# EAGLE design uno_sensor_shield (EAGLE 9.1.0)

## Sheet 1 of 2
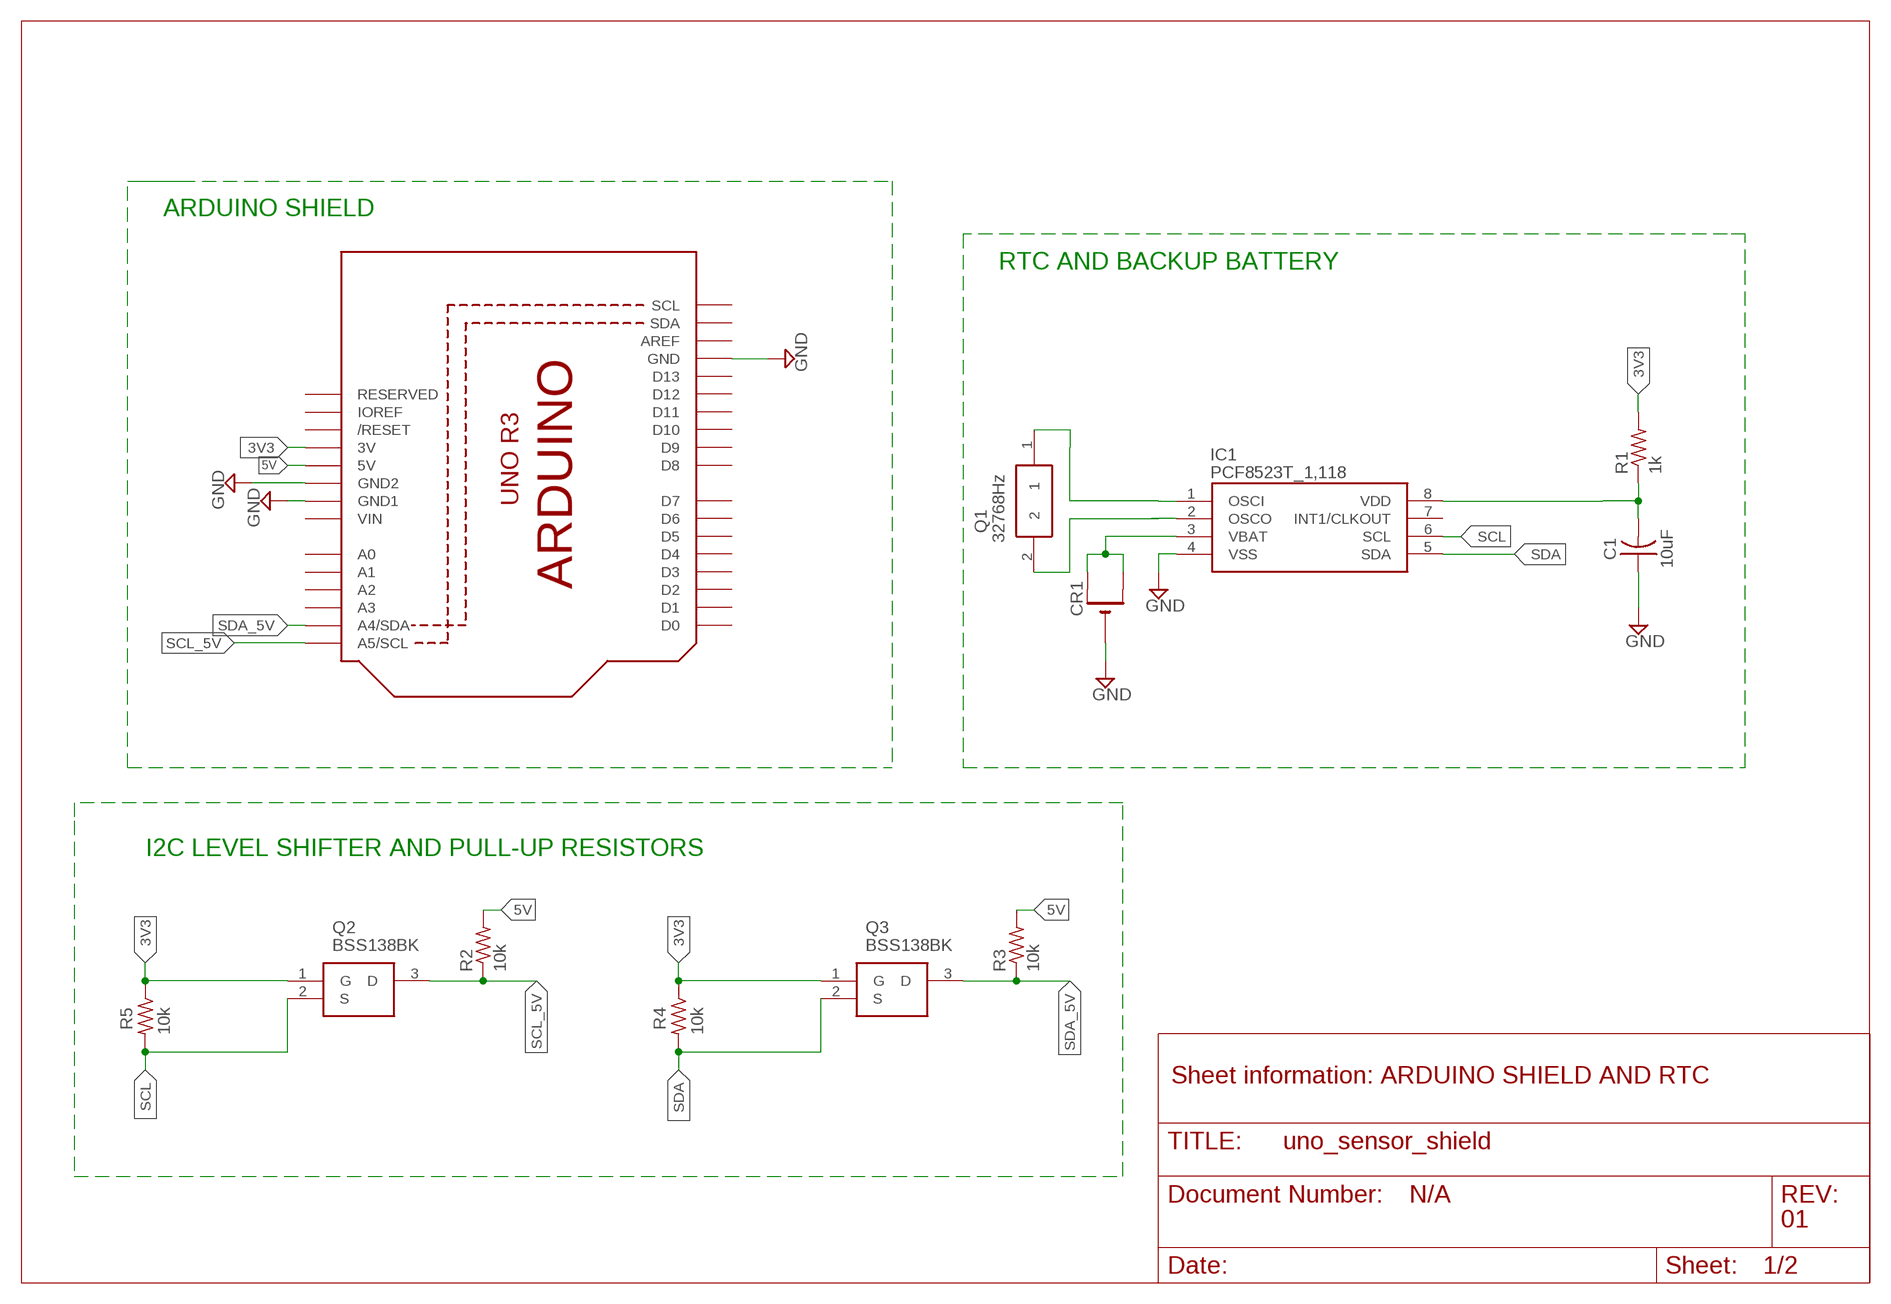
[diagram p0: schematic, sheet 1]

### Parts
C1  10uF  C-USC0805  [C0805]
CR1  CR1220SMT  [CR1220-SMD]
IC1  PCF8523T_1,118  [SOIC127P600X175-8N]
Q1  32768Hz  Q_0.032768-JTX210-12.5-20-T1-L  [Q0032768JTX21012520T1LF]
Q2  BSS138BK  [SOT95P230X110-3N]
Q3  BSS138BK  [SOT95P230X110-3N]
R1  1k  R-US_R0805  [R0805]
R2  10k  R-US_R0805  [R0805]
R3  10k  R-US_R0805  [R0805]
R4  10k  R-US_R0805  [R0805]
R5  10k  R-US_R0805  [R0805]
U1  ARDUINOR3-DIMENSION  [ARDUINOR3]

### Nets
3V3: Q2.1(G) Q3.1(G) R1.2 R4.1 R5.1 U1.3V ; also sheet 2
5V: R2.2 R3.2 U1.5V
GND: C1.1 CR1.- IC1.4(VSS) U1.GND U1.GND1 U1.GND2 ; also sheet 2
N$4: IC1.2(OSCO) Q1.2
N$5: C1.2 IC1.8(VDD) R1.1
N$11: IC1.1(OSCI) Q1.1
SCL: IC1.6(SCL) Q2.2(S) R5.2 ; also sheet 2
SCL_5V: Q2.3(D) R2.1 U1.A5(A5/SCL)
SDA: IC1.5(SDA) Q3.2(S) R4.2 ; also sheet 2
SDA_5V: Q3.3(D) R3.1 U1.A4(A4/SDA)
VBAT: CR1.+$1(+) CR1.+$2(+1) IC1.3(VBAT)
Unconnected: IC1.7(INT1/CLKOUT) U1.A0 U1.A1 U1.A2 U1.A3 U1.AREF U1.D0 U1.D1 U1.D2 U1.D3 U1.D4 U1.D5 U1.D6 U1.D7 U1.D8 U1.D9 U1.D10 U1.D11 U1.D12 U1.D13 U1.IOREF U1.RESERVED U1.RESET(/RESET) U1.SCL U1.SDA

### Notes on the sheet
- ARDUINO SHIELD
- RTC AND BACKUP BATTERY
- I2C LEVEL SHIFTER AND PULL-UP RESISTORS
- Sheet information: ARDUINO SHIELD AND RTC
- N/A
- 01

## Sheet 2 of 2
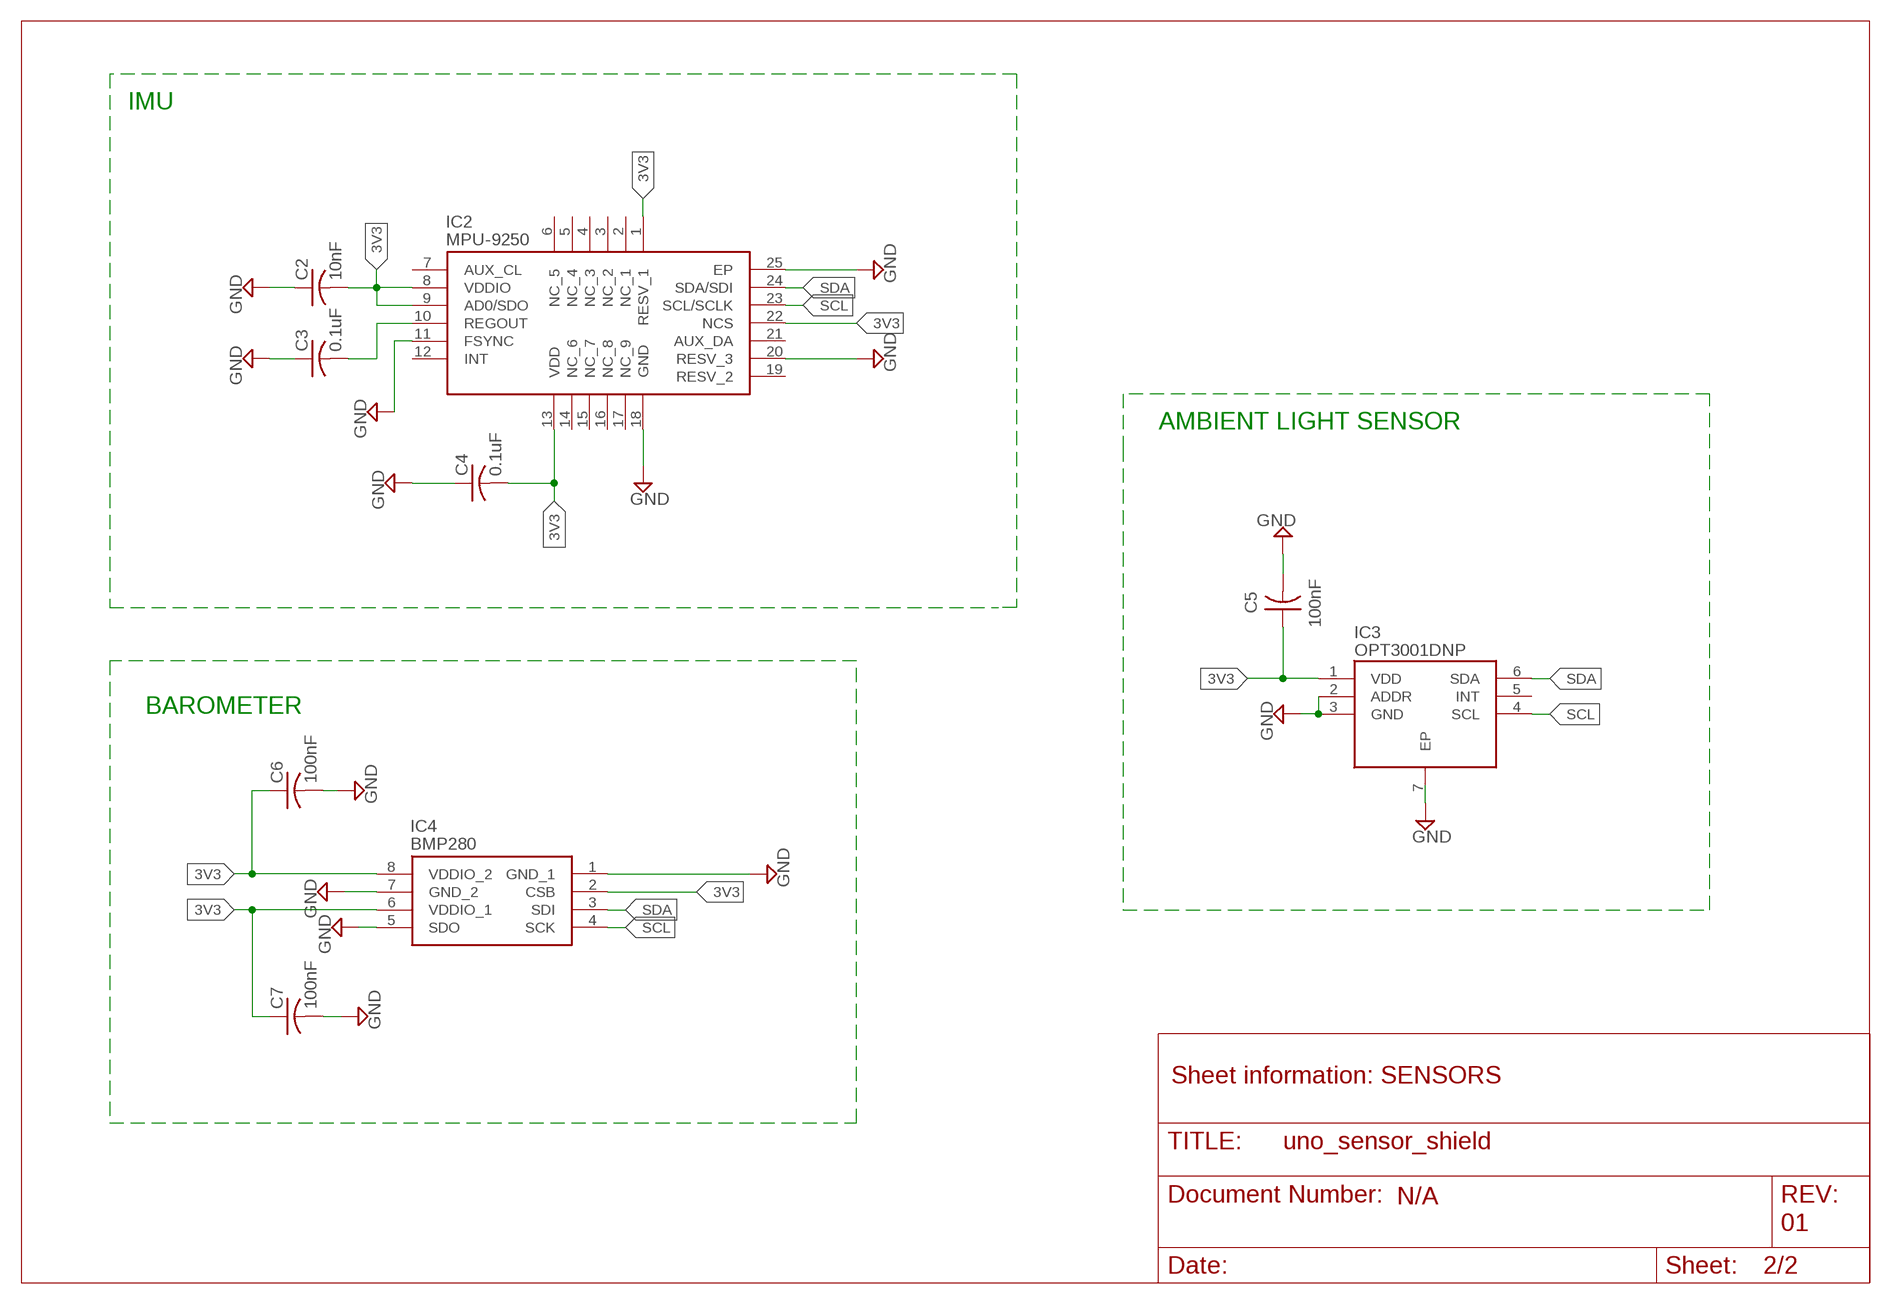
[diagram p1: schematic, sheet 2]

### Parts
C2  10nF  C-USC0805  [C0805]
C3  0.1uF  C-USC0805  [C0805]
C4  0.1uF  C-USC0805  [C0805]
C5  100nF  C-USC0805  [C0805]
C6  100nF  C-USC0805  [C0805]
C7  100nF  C-USC0805  [C0805]
IC2  MPU-9250  [QFN40P300X300X105-25N]
IC3  OPT3001DNP  [SON65P200X200X65-7N]
IC4  BMP280  [8-PIN-METAL-LID-LGA]

### Nets
3V3: C2.2 C4.2 C5.1 C6.1 C7.1 IC2.1(RESV_1) IC2.8(VDDIO) IC2.9(AD0/SDO) IC2.13(VDD) IC2.22(NCS) IC3.1(VDD) IC4.2(CSB) IC4.6(VDDIO_1) IC4.8(VDDIO_2) ; also sheet 1
GND: C2.1 C3.1 C4.1 C5.2 C6.2 C7.2 IC2.11(FSYNC) IC2.18(GND) IC2.20(RESV_3) IC2.25(EP) IC3.2(ADDR) IC3.3(GND) IC3.7(EP) IC4.1(GND_1) IC4.5(SDO) IC4.7(GND_2) ; also sheet 1
N$2: C3.2 IC2.10(REGOUT)
SCL: IC2.23(SCL/SCLK) IC3.4(SCL) IC4.4(SCK) ; also sheet 1
SDA: IC2.24(SDA/SDI) IC3.6(SDA) IC4.3(SDI) ; also sheet 1
Unconnected: IC2.2(NC_1) IC2.3(NC_2) IC2.4(NC_3) IC2.5(NC_4) IC2.6(NC_5) IC2.7(AUX_CL) IC2.12(INT) IC2.14(NC_6) IC2.15(NC_7) IC2.16(NC_8) IC2.17(NC_9) IC2.19(RESV_2) IC2.21(AUX_DA) IC3.5(INT)

### Notes on the sheet
- IMU
- AMBIENT LIGHT SENSOR
- BAROMETER
- Sheet information: SENSORS
- N/A
- 01

## Power pins joined to a net without a drawn wire
VIN: U1.VIN

## Library data of the parts
C1-C7 = adafruit:C-US: CAPACITOR, American symbol; OC_NEWARK: unknown
CR1 = adafruit:CR1220: CR1216/CR1220/CR1225 12mm 3V lithium coin cell Great for battery packup. Both SMT and THM holders. Note the THM package has the ground pads on both sides of the PCB so that the masks are the same - this reduces the cost; OC_NEWARK: unknown
IC1 = PCF8523T_1_118:PCF8523T_1,118: NXP - PCF8523T/1,118 - REAL TIME CLOCK/CALENDAR, I2C, SOIC-8 Source: Datasheet <http://www.mouser.com/ds/2/302/PCF8523-841839.pdf>; ARROW_PART_NUMBER: PCF8523T/1,118; ARROW_PRICE/STOCK: https://www.arrow.com/en/products/pcf8523t1118/nxp-semiconductors; DESCRIPTION: NXP - PCF8523T/1,118 - REAL TIME CLOCK/CALENDAR, I2C, SOIC-8; HEIGHT: 1.75mm; MANUFACTURER_NAME: Nexperia; MANUFACTURER_PART_NUMBER: PCF8523T/1,118; OC_NEWARK: unknown
IC2 = MPU-9250:MPU-9250: 9-Axis Motion Sensor Module, 25 to 29 kHz, 2.4 to 3.6 V Source: Datasheet <http://docs-asia.electrocomponents.com/webdocs/1414/0900766b81414edb.pdf>; ARROW_PART_NUMBER: MPU-9250; ARROW_PRICE/STOCK: http://uk.rs-online.com/web/p/products/8837942; DESCRIPTION: 9-Axis Motion Sensor Module, 25 to 29 kHz, 2.4 to 3.6 V; HEIGHT: 1.05mm; MANUFACTURER_NAME: InvenSense Inc.; MANUFACTURER_PART_NUMBER: MPU-9250; OC_NEWARK: unknown; RS_PART_NUMBER: 8837942; RS_PRICE/STOCK: http://uk.rs-online.com/web/p/products/8837942
IC3 = OPT3001DNP:OPT3001DNP: light sensor IC Source: Datasheet <http://docs-europe.electrocomponents.com/webdocs/1475/0900766b814751e4.pdf>; ARROW_PART_NUMBER: OPT3001DNP; DESCRIPTION: light sensor IC; HEIGHT: 0.65mm; MANUFACTURER_NAME: Texas Instruments; MANUFACTURER_PART_NUMBER: OPT3001DNP; OC_NEWARK: unknown; RS_PART_NUMBER: 9009810; SPICEPREFIX: X
IC4 = bmp280:BMP280: Digital Pressure Sensor Source: Datasheet <https://ae-bst.resource.bosch.com/media/products/dokumente/bmp280/BST-BMP280-DS001-11.pdf>; ARROW_PART_NUMBER: bmp280; DESCRIPTION: Digital Pressure Sensor; HEIGHT: mm; MANUFACTURER_NAME: Bosch Sensortec; MANUFACTURER_PART_NUMBER: bmp280; OC_NEWARK: unknown
Q1 = Q_0.032768-JTX210-12.5-20-T1-L:Q_0.032768-JTX210-12.5-20-T1-L: CRYSTAL 32.768KHZ 12.5PF SMD Source: Datasheet <http://www.jauch.com/downloadfile/57fdee20c97be_5168d2c2857c0acc97df/jtx210-20171218.pdf>; ARROW_PART_NUMBER: Q 0.032768-JTX210-12.5-20-T1-LF; DESCRIPTION: CRYSTAL 32.768KHZ 12.5PF SMD; HEIGHT: 0mm; MANUFACTURER_NAME: Jauch Quartz; MANUFACTURER_PART_NUMBER: Q 0.032768-JTX210-12.5-20-T1-LF
Q2 Q3 = BSS138BK:BSS138BK: MOSFET,n-channel,60V,360mA,1ohm,SOT23 NXP BSS138BK N-channel MOSFET Transistor, 0.36 A, 60 V, 3-Pin SOT-23 Source: Datasheet <http://docs-europe.electrocomponents.com/webdocs/1270/0900766b81270fbc.pdf>; ARROW_PART_NUMBER: BSS138BK; ARROW_PRICE/STOCK: http://uk.rs-online.com/web/p/products/7920894P; DESCRIPTION: MOSFET,n-channel,60V,360mA,1ohm,SOT23 NXP BSS138BK N-channel MOSFET Transistor, 0.36 A, 60 V, 3-Pin SOT-23; HEIGHT: 1.1mm; MANUFACTURER_NAME: Nexperia; MANUFACTURER_PART_NUMBER: BSS138BK; OC_NEWARK: unknown; RS_PART_NUMBER: 7920894P; RS_PRICE/STOCK: http://uk.rs-online.com/web/p/products/7920894P
R1-R5 = adafruit:R-US_: RESISTOR, American symbol; OC_NEWARK: unknown
U1 = adafruit:ARDUINOR3: This is a new object for the new Arduino R3 - with extra pins that you may want to use (such as IOref, and duplicated A4/A5; OC_NEWARK: unknown

## Board
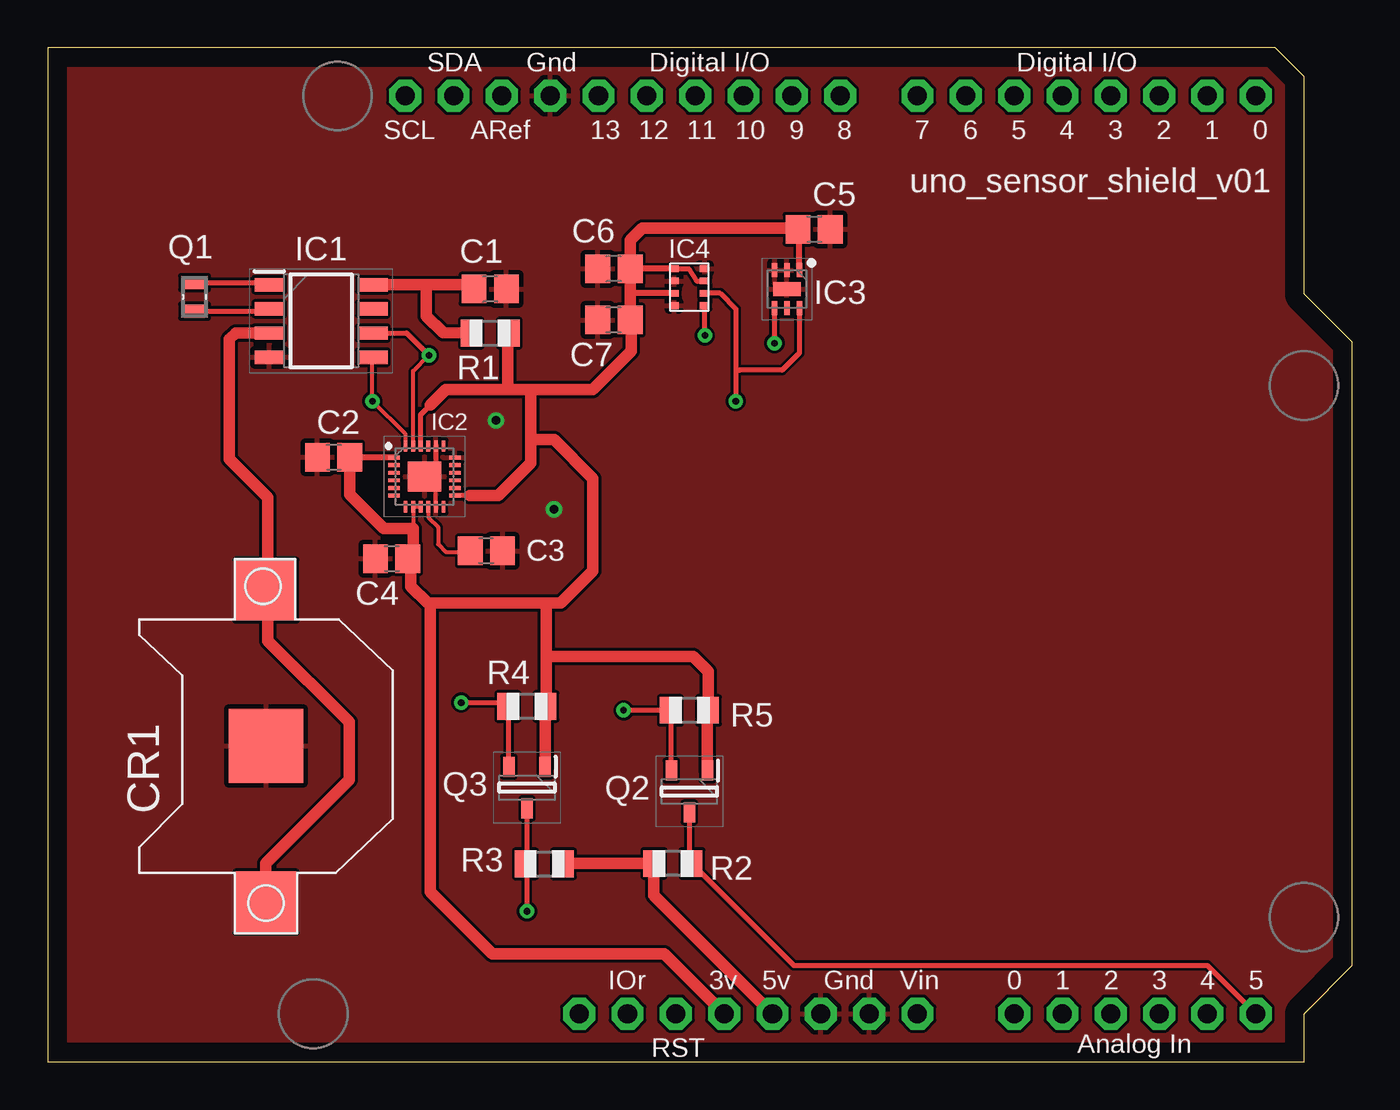
[diagram p2: board, top side]
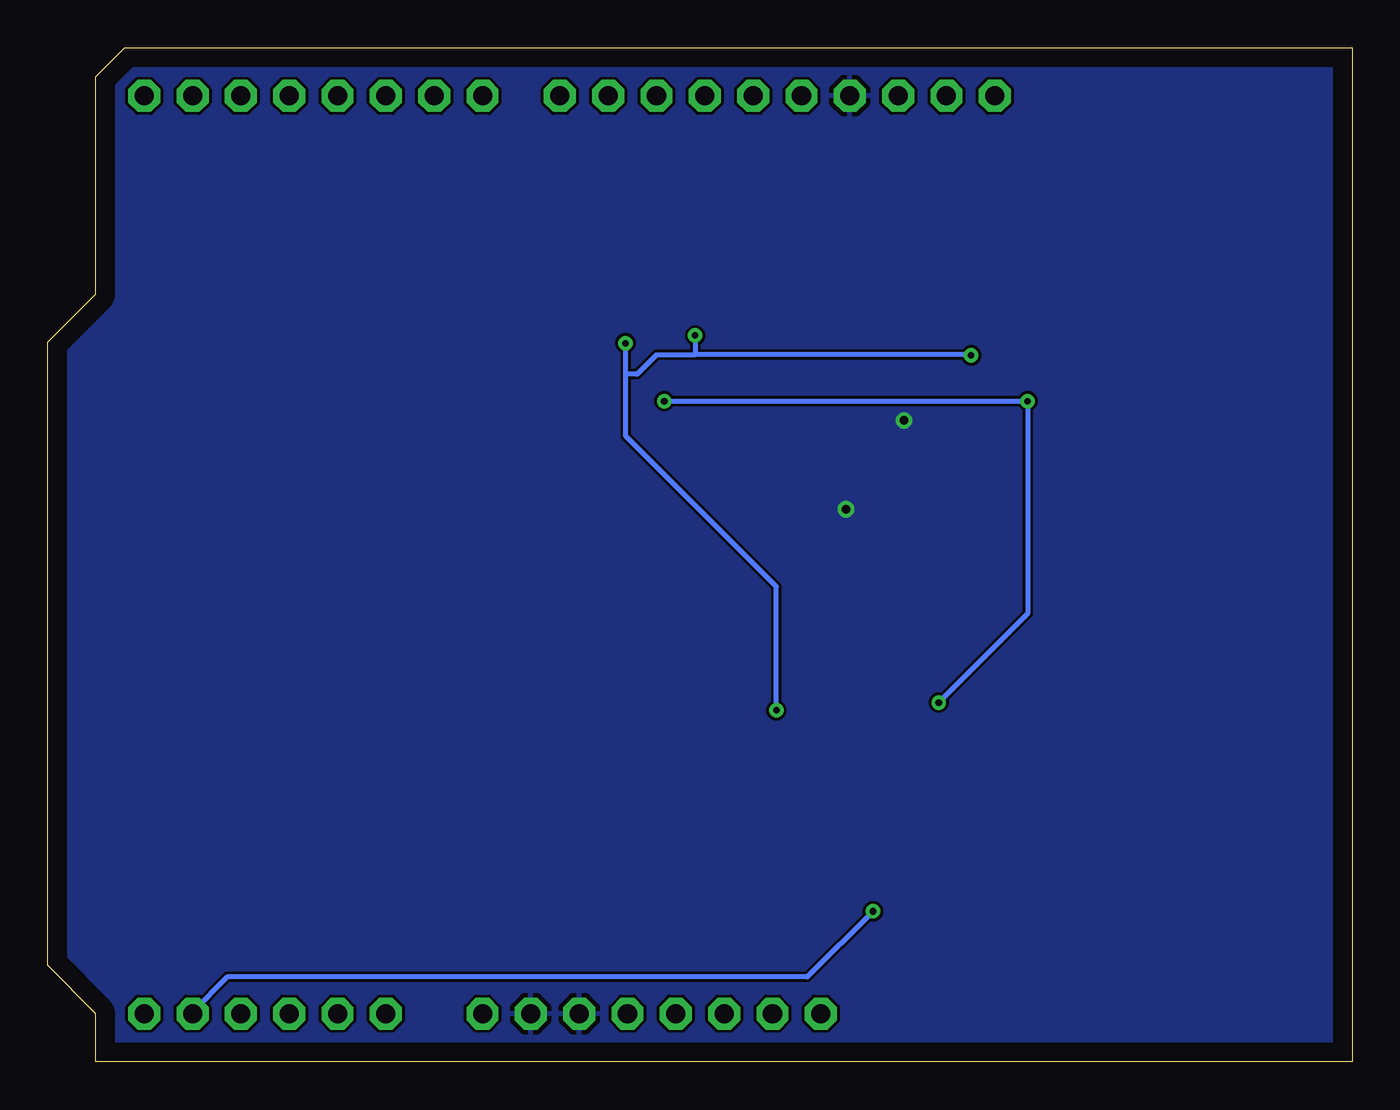
[diagram p3: board, bottom side, seen from below]

Size 68.58 x 53.34 mm. Coordinates in mm from the lower left corner, seen from the top.
Copper layers (1*16): Top 0.035mm / dielectric 1.5mm / Bottom 0.035mm
Design rules "default": minimum track width 6mil, minimum drill 0.35mm, track to track 6mil, track to pad 6mil, pad to pad 6mil, via to via 6mil, smd to smd 6mil, copper to edge 40mil, drill to drill 6mil, minimum pad ring 10mil, minimum via ring 8mil, stop-mask expansion 4mil, vias tented up to drill 0mil, thermal gap 10mil

### Footprints (pad centres in the part's own frame; a part is rotated, then mirrored left to right if it is on the bottom)
C0805 = smd 1.3 x 1.5: 1 -0.85,0; 2 0.85,0
CR1220-SMD = smd 3.2 x 3.2: +$1 -8.2,0; +$2 8.2,0 | smd 3.9 x 3.9: - 0,0
SOIC127P600X175-8N = smd 1.55 x 0.7: 1 -2.725,1.905; 2 -2.725,0.635; 3 -2.725,-0.635; 4 -2.725,-1.905; 5 2.725,-1.905; 6 2.725,-0.635; 7 2.725,0.635; 8 2.725,1.905
QFN40P300X300X105-25N = smd 0.6 x 0.2: 1 -1.6,1; 2 -1.6,0.6; 3 -1.6,0.2; 4 -1.6,-0.2; 5 -1.6,-0.6; 6 -1.6,-1; 13 1.6,-1; 14 1.6,-0.6; 15 1.6,-0.2; 16 1.6,0.2; 17 1.6,0.6; 18 1.6,1 | smd 0.2 x 0.6: 7 -1,-1.6; 8 -0.6,-1.6; 9 -0.2,-1.6; 10 0.2,-1.6; 11 0.6,-1.6; 12 1,-1.6; 19 1,1.6; 20 0.6,1.6; 21 0.2,1.6; 22 -0.2,1.6; 23 -0.6,1.6; 24 -1,1.6 | smd 1.75 x 1.59: 25 0,0
SON65P200X200X65-7N = smd 0.75 x 0.3: 1 -1,0.65; 2 -1,0; 3 -1,-0.65; 4 1,-0.65; 5 1,0; 6 1,0.65 | smd 0.75 x 1.45: 7 0,0
8-PIN-METAL-LID-LGA = smd 0.5 x 0.35: 1 0.8,0.975; 2 0.8,0.325; 3 0.8,-0.325; 4 0.8,-0.975; 5 -0.8,-0.975; 6 -0.8,-0.325; 7 -0.8,0.325; 8 -0.8,0.975
Q0032768JTX21012520T1LF = smd 0.7 x 1.4: 1 -0.75,0; 2 0.75,0
SOT95P230X110-3N = smd 1.05 x 0.6: 1 -1.1,0.95; 2 -1.1,-0.95; 3 1.1,0
R0805 = smd 1.1 x 1.4: 1 -1,0; 2 1,0
ARDUINOR3 = drill 1 pad 1.676 octagon: 3V 35.56,2.54; 5V 38.1,2.54; A0 50.8,2.54; A1 53.34,2.54; A2 55.88,2.54; A3 58.42,2.54; A4 60.96,2.54; A5 63.5,2.54; AREF 23.876,50.8; D0 63.5,50.8; D1 60.96,50.8; D2 58.42,50.8; D3 55.88,50.8; D4 53.34,50.8; D5 50.8,50.8; D6 48.26,50.8; D7 45.72,50.8; D8 41.656,50.8; D9 39.116,50.8; D10 36.576,50.8; D11 34.036,50.8; D12 31.496,50.8; D13 28.956,50.8; GND 26.416,50.8; GND1 43.18,2.54; GND2 40.64,2.54; IOREF 30.48,2.54; RESERVED 27.94,2.54; RESET 33.02,2.54; SCL 18.796,50.8; SDA 21.336,50.8; VIN 45.72,2.54

### Placement (x,y rotation side)
C1  23.27,40.64 180 top
C2  15.04,31.8 0 top
C3  23.06,26.87 180 top
C4  18.08,26.47 0 top
C5  40.28,43.79 0 top
C6  29.77,41.71 180 top
C7  29.77,39.01 180 top
CR1  11.48,16.61 90 top
IC1  14.38,38.96 0 top
IC2  19.81,30.78 0 top
IC3  38.86,40.64 270 top
IC4  33.73,40.74 0 top
Q1  7.72,40.23 270 top
Q2  33.73,14.22 270 top
Q3  25.2,14.43 270 top
R1  23.27,38.33 0 top
R2  32.87,10.44 180 top
R3  26.11,10.41 0 top
R4  25.2,18.69 180 top
R5  33.73,18.49 180 top
U1  0,0 0 top

### Tracks (layer width: path | path; a pad name or v marks a point on that pad's centre or on a via)
3V3
  Top 0.203: 18.2,31.8 IC2.1 | IC2.9 IC2.8 19.21,28.04
  Top 0.254: IC4.8 33.71,41.7 34.11,41.07 IC4.2 | 22.2,29.79 IC2.13 | IC2.22 19.61,34.04 20.12,34.54
  Top 0.305: IC4.8 30.68,41.72 | C2.2 18.2,31.8 | 19.2,28.04 19.21,28.04 | IC4.6 32.91,40.44 30.62,40.44 | IC3.1 39.51,43.71 C5.1
  Top 0.406: 30.68,41.72 C6.1
  Top 0.61: C2.2 15.89,29.83 17.68,28.04 19.2,28.04 | 26.21,24.12 26.97,24.12 28.65,25.81 28.65,30.68 26.62,32.72 25.4,32.72 | 26.21,24.12 22.76,24.12 20.12,24.12 | 25.4,32.72 25.4,31.5 23.69,29.79 22.2,29.79 | 24.18,35.36 25.4,35.36 | 25.4,35.36 25.4,32.72 | R1.2 24.18,38.24 24.18,35.36 | 25.4,35.36 28.65,35.36 30.68,37.39 30.68,38.95 C7.1 30.62,40.44 30.62,41.65 30.68,41.72 | 24.18,35.36 20.93,35.36 20.12,34.54 | 19.21,28.04 19.21,26.74 C4.2 19.1,26.3 19.1,24.99 19.97,24.12 20.12,24.12 | Q3.1 26.15,18.64 R4.1 26.21,18.71 26.21,21.34 | Q2.1 34.68,18.44 R5.1 34.73,20.54 33.93,21.34 26.21,21.34 | C6.1 30.62,43.22 31.24,43.84 39.46,43.84 39.43,43.81 C5.1 | U1.3V 32.41,5.69 23.37,5.69 20.12,8.94 20.12,24.12 | 26.21,21.34 26.21,24.12
5V
  Top 0.61: U1.5V 31.87,8.77 R2.2 27.14,10.44 R3.2
GND  (via drill 0.45)
  Top 0.203: IC2.11 20.41,30.17 20.41,30.18 IC2.25 20.32,31.29 20.52,31.29
  Top 0.254: IC2.20 20.41,31.4
  Top 0.305: 20.52,31.29 20.41,31.4
  other vias: 23.57,33.73 26.62,29.06
  pour Bottom: -2.54,55.88 -2.54,-2.54 71.12,-2.54 71.12,55.88
  pour Top: -2.03,-2.03 71.32,-2.03 71.32,54.05 -2.03,54.05
N$2
  Top 0.203: 22.15,26.87 22.1,26.82 20.93,26.82 20.52,27.23 20.52,28.12 20.01,28.63 IC2.10
  Top 0.305: 22.15,26.87 C3.2
N$4
  Top 0.254: Q1.2 11.54,39.48 IC1.2
N$5
  Top 0.305: 22.19,40.87 C1.2
  Top 0.61: IC1.8 19.91,40.87 | 19.91,40.87 22.19,40.87 | R1.1 20.79,38.34 19.91,39.22 19.91,40.87
N$11
  Top 0.254: Q1.1 11.54,40.98 IC1.1
SCL  (via drill 0.35)
  Top 0.203: v34.54,38.2 34.53,38.21 | v20.04,37.16 19.21,36.33 IC2.23
  Top 0.254: 34.53,38.21 IC4.4 | v20.04,37.16 18.87,38.33 IC1.6 | Q2.2 32.78,18.44 R5.2 v30.28,18.49 | IC3.4 v38.2,37.8
  Bottom 0.254: v34.54,38.2 34.54,37.19 | 34.54,37.19 20.07,37.19 v20.04,37.16 | 34.54,37.19 36.58,37.19 37.59,36.17 38.2,36.17 | v30.28,18.49 30.28,24.99 38.2,32.92 38.2,36.17 | 38.2,36.17 38.2,36.37 v38.2,37.8
SCL_5V
  Top 0.254: U1.A5 60.96,5.08 39.23,5.08 R2.1 33.73,10.58 Q2.3
SDA  (via drill 0.35)
  Top 0.203: IC2.24 18.81,33 v17.07,34.75 17.07,37.02
  Top 0.254: IC4.3 35.35,40.42 36.17,39.6 36.17,38 36.17,37.39 36.17,36.37 | IC1.5 17.07,37.02 | Q3.2 24.25,18.64 R4.2 23.99,18.9 v21.74,18.9 | IC3.6 39.51,37.28 38.61,36.37 36.37,36.37 36.17,36.37 | 36.17,36.37 v36.17,34.75
  Bottom 0.254: v21.74,18.9 17.07,23.57 v17.07,34.75 v36.17,34.75
SDA_5V  (via drill 0.35)
  Top 0.254: Q3.3 25.2,10.5 | 25.2,10.5 R3.1 | 25.2,10.5 v25.2,7.92
  Bottom 0.254: v25.2,7.92 28.65,4.47 59.13,4.47 60.96,2.64 U1.A4
VBAT
  Top 0.61: IC1.3 9.88,38.33 9.55,38 9.55,31.7 11.58,29.67 11.58,24.71 | CR1.+$1 11.46,8.44 11.46,10.44 15.85,14.83 15.85,17.88 11.58,22.15 11.58,24.71 | 11.58,24.71 CR1.+$2

### Text on the board
tNames: uno_sensor_shield_v01